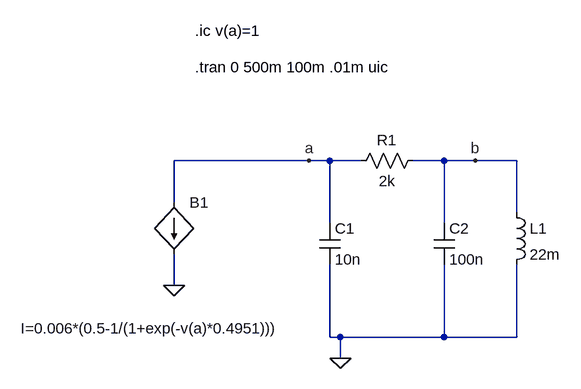
[diagram p0: schematic chua5.asc]
chua5.asc, the LTspice schematic file:
Version 4
SHEET 1 1624 680
WIRE 752 0 544 0
WIRE 784 0 752 0
WIRE 832 0 784 0
WIRE 960 0 912 0
WIRE 1008 0 960 0
WIRE 1072 0 1008 0
WIRE 544 64 544 0
WIRE 1072 80 1072 0
WIRE 784 96 784 0
WIRE 960 96 960 0
WIRE 544 192 544 144
WIRE 784 272 784 160
WIRE 800 272 784 272
WIRE 960 272 960 160
WIRE 960 272 800 272
WIRE 1072 272 1072 160
WIRE 1072 272 960 272
WIRE 800 304 800 272
FLAG 800 304 0
FLAG 752 0 a
FLAG 544 192 0
FLAG 1008 0 b
SYMBOL cap 768 96 R0
SYMATTR InstName C1
SYMATTR Value 10n
SYMBOL cap 944 96 R0
SYMATTR InstName C2
SYMATTR Value 100n
SYMBOL res 928 -16 R90
WINDOW 0 0 56 VBottom 2
WINDOW 3 32 56 VTop 2
SYMATTR InstName R1
SYMATTR Value 2k
SYMBOL ind 1056 64 R0
SYMATTR InstName L1
SYMATTR Value 22m
SYMBOL bi 544 64 R0
WINDOW 3 -236 194 Left 2
SYMATTR Value I=0.006*(0.5-1/(1+exp(-v(a)*0.4951)))
SYMATTR InstName B1
TEXT 576 -200 Left 2 !.ic v(a)=1
TEXT 576 -144 Left 2 !.tran 0 500m 100m .01m uic

The netlist it stands for:
* chua5.asc
C1 a 0 10n
C2 b 0 100n
R1 b a 2k
L1 b 0 22m
B1 a 0 I=0.006*(0.5-1/(1+exp(-v(a)*0.4951)))
.ic v(a)=1
.tran 0 500m 100m .01m uic
.backanno
.end